# EAGLE design nrf24wifidongle (EAGLE 6.6.0)
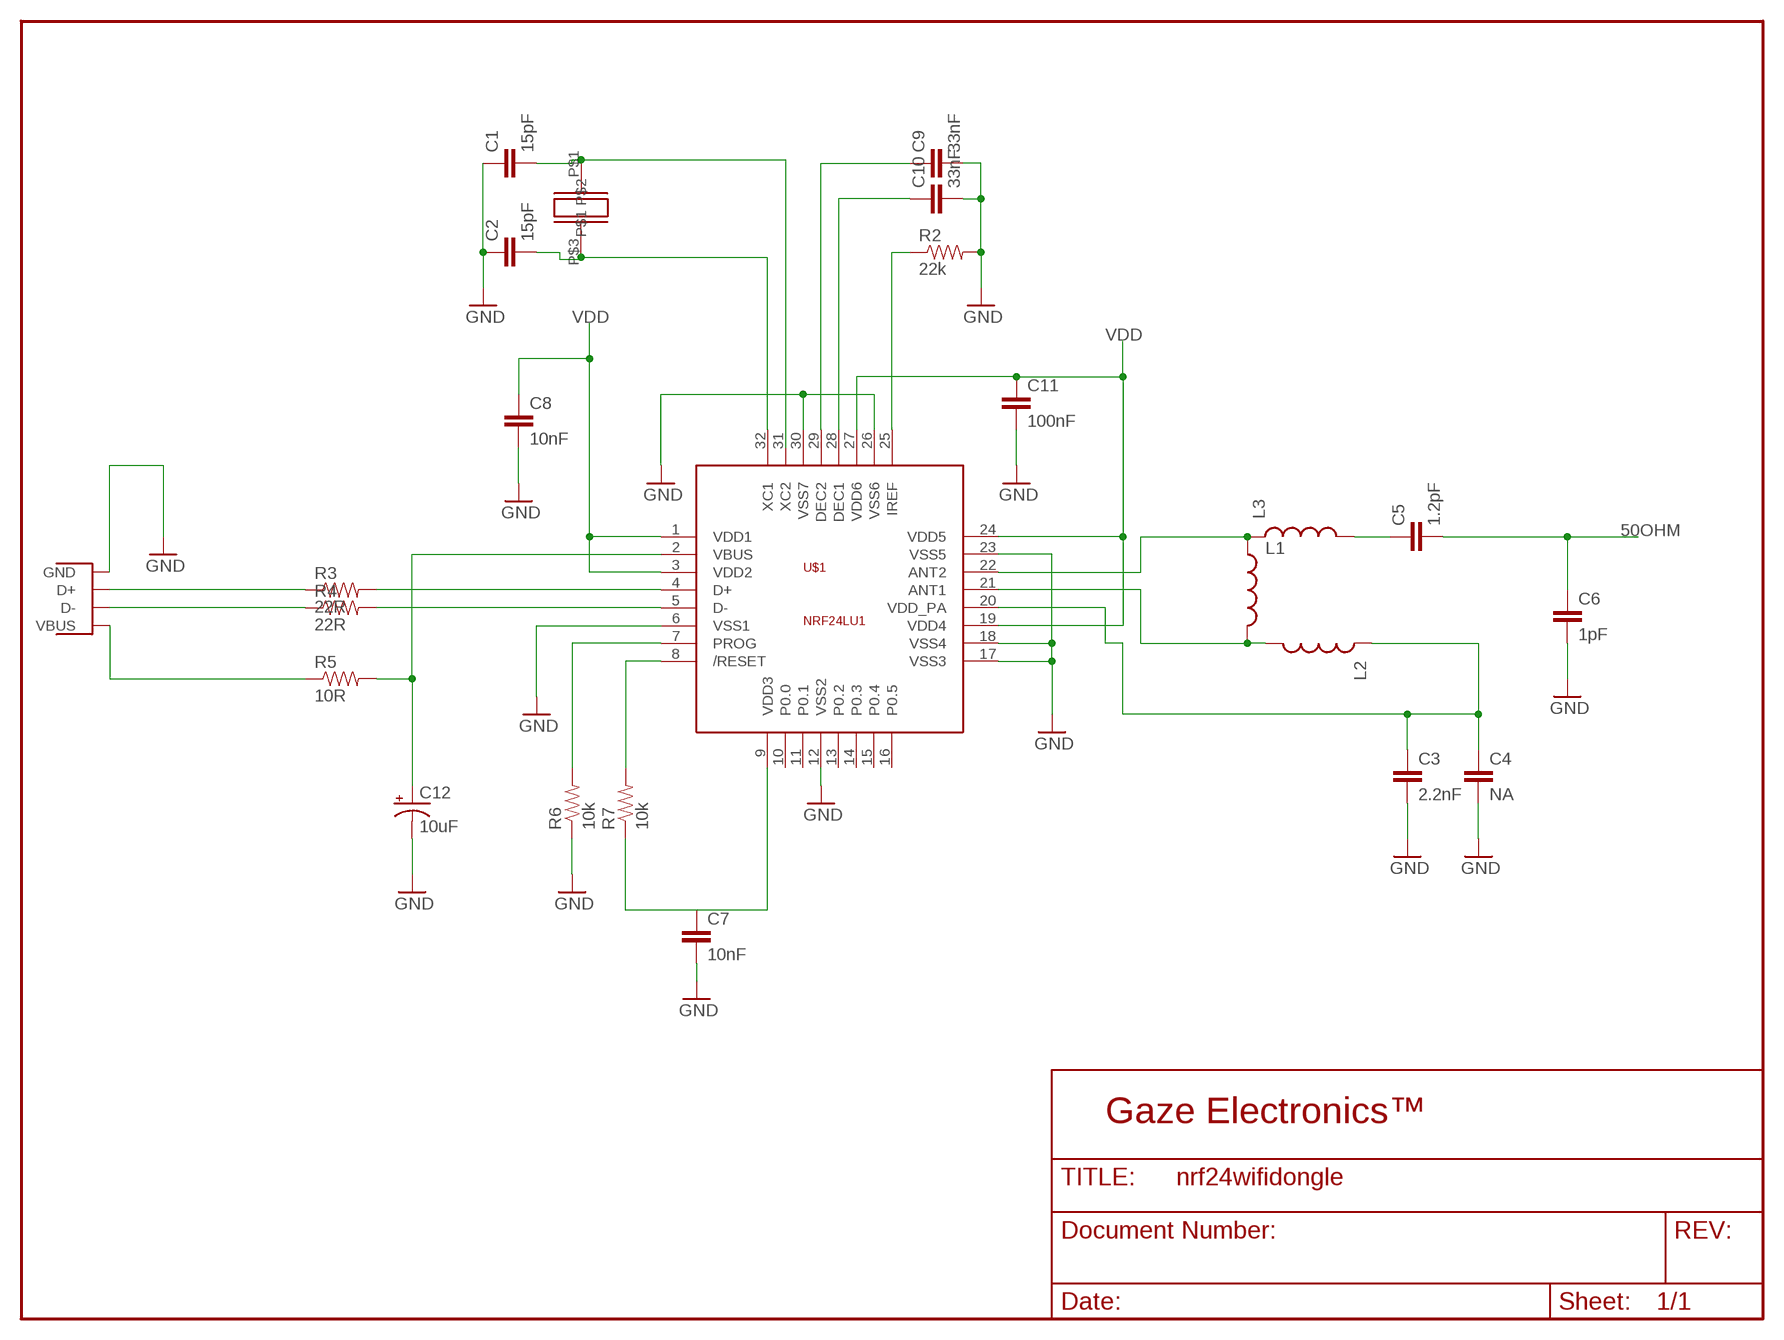
[diagram p0: schematic, sheet 1]

## Parts
C1  15pF  CAP0402  [C0402]
C2  15pF  CAP0402  [C0402]
C3  2.2nF  CAP0402  [C0402]
C4  NA  CAP0402  [C0402]
C5  1.2pF  CAP0402  [C0402]
C6  1pF  CAP0402  [C0402]
C7  10nF  CAP0402  [C0402]
C8  10nF  CAP0402  [C0402]
C9  33nF  CAP0402  [C0402]
C10  33nF  CAP0402  [C0402]
C11  100nF  CAP0402  [C0402]
C12  10uF  CAP_POL1206  [EIA3216]
L1  INDUCTOR0402  [C0402]
L2  INDUCTOR0402  [C0402]
L3  INDUCTOR0402  [C0402]
R2  22k  RESISTOR0402-RES  [0402-RES]
R3  22R  RESISTOR0402-RES  [0402-RES]
R4  22R  RESISTOR0402-RES  [0402-RES]
R5  10R  RESISTOR0402-RES  [0402-RES]
R6  10k  RESISTOR0402-RES  [0402-RES]
R7  10k  RESISTOR0402-RES  [0402-RES]
U$1  NRF24LU1  [QFN-32]
U$2  CFPX180  [CFPX180]
X1  USBPTH  [USB-B-PTH]

## Nets
50OHM: C5.2 C6.1
GND: C1.1 C2.1 C3.2 C4.2 C6.2 C7.2 C8.2 C9.2 C10.2 C11.2 C12.C(-) R2.2 R6.1 U$1.6(VSS1) U$1.12(VSS2) U$1.17(VSS3) U$1.18(VSS4) U$1.23(VSS5) U$1.26(VSS6) U$1.30(VSS7) X1.GND
N$1: R3.2 U$1.4(D+)
N$2: R4.2 U$1.5(D-)
N$3: R3.1 X1.D+
N$4: R4.1 X1.D-
N$5: C1.2 U$2.P$1
N$6: C2.2 U$1.32(XC1) U$2.P$3
N$7: C9.1 U$1.29(DEC2)
N$8: R5.1 X1.VBUS
N$9: C12.A(+) R5.2 U$1.2(VBUS)
N$10: R6.2 U$1.7(PROG)
N$11: R7.2 U$1.8(/RESET)
N$12: R7.1 U$1.9(VDD3)
N$13: R2.1 U$1.25(IREF)
N$14: C5.1 L3.2
N$15: C10.1 U$1.28(DEC1)
N$18: L1.1 L3.1 U$1.22(ANT2)
N$20: C3.1 C4.1 L2.1 U$1.20(VDD_PA)
N$21: L1.2 L2.2 U$1.21(ANT1)
VDD: C8.1 C11.1 U$1.1(VDD1) U$1.3(VDD2) U$1.19(VDD4) U$1.24(VDD5) U$1.27(VDD6)
Unconnected: C7.1 U$1.10(P0.0) U$1.11(P0.1) U$1.13(P0.2) U$1.14(P0.3) U$1.15(P0.4) U$1.16(P0.5) U$1.31(XC2)

## Library data of the parts
C1-C11 = CH_passive:CAP: Capacitor Standard 0603 ceramic capacitor, and 0.1" leaded capacitor.
C12 = CH_passive:CAP_POL: Capacitor Polarized These are standard SMD and PTH capacitors. Normally 10uF, 47uF, and 100uF in electrolytic and tantalum varieties. Always verify the external diameter of the through hole cap, it varies with capacity, voltage, and manufacturer. The EIA devices should be standard.
L1-L3 = CH_passive:INDUCTOR: Inductors Basic Inductor
R2-R7 = Gaze Electronics - Passives:RESISTOR: Resistor Basic schematic elements and footprints for 0603, 1206, and PTH resistors.
U$1 = Gaze Electronics - RF:NRF24LU1: 2.4GHz transceiver
U$2 = ABCDEFG:CFPX180
X1 = CH_connectors:USB: USB Connectors USB-B-PTH is fully proven SKU : PRT-00139 USB-miniB is fully proven SKU : PRT-00587 USB-A-PCB is untested. USB-A-H is C@H proven USB-B-SMT is throughly reviewed, but untested. Needs silkscreen touching up. USB-A-S has not been used/tested USB-MB-H has not been used/tested

## Board
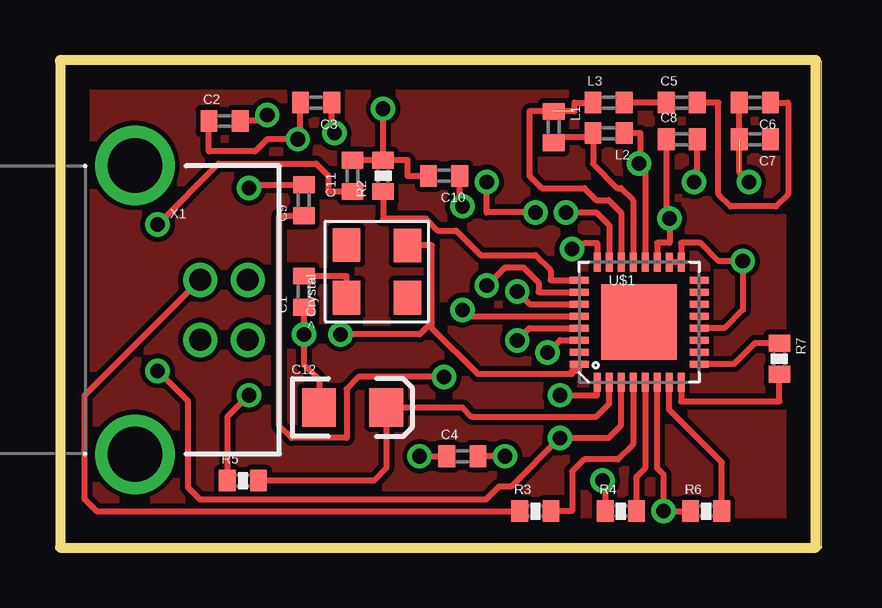
[diagram p1: board, top side]
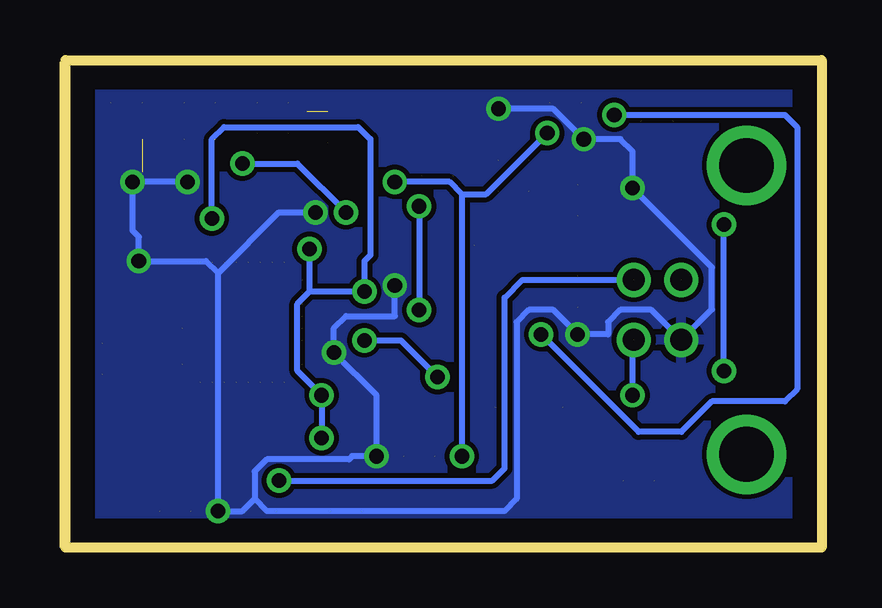
[diagram p2: board, bottom side, seen from below]

Size 31.73 x 20.32 mm. Coordinates in mm from the lower left corner, seen from the top.
Outline: 31.5,0 31.73,0 31.73,20.24 0,20.24
Outline: 31.5,0 0,0 0,20.24
Outline: 31.5,0 31.5,20.32 0,20.32 0,20.24
Copper layers (1*16): Top 0.035mm / dielectric 1.5mm / Bottom 0.035mm
Design rules "default": minimum track width 10mil, minimum drill 24mil, track to track 8mil, track to pad 8mil, pad to pad 8mil, via to via 8mil, smd to smd 8mil, copper to edge 40mil, drill to drill 8mil, minimum pad ring 10mil, minimum via ring 8mil, stop-mask expansion 4mil, vias tented up to drill 0mil, thermal gap 10mil

### Footprints (pad centres in the part's own frame; a part is rotated, then mirrored left to right if it is on the bottom)
C0402 = smd 0.7 x 0.9: 1 -0.65,0; 2 0.65,0
EIA3216 = smd 1.4 x 1.6: A 1.4,0; C -1.4,0
0402-RES = smd 0.7 x 0.9: 1 -0.65,0; 2 0.65,0
QFN-32 = smd 0.285 x 0.8: 1 -1.75,-2.5; 2 -1.25,-2.5; 3 -0.75,-2.5; 4 -0.25,-2.5; 5 0.25,-2.5; 6 0.75,-2.5; 7 1.25,-2.5; 8 1.75,-2.5; 17 1.75,2.5; 18 1.25,2.5; 19 0.75,2.5; 20 0.25,2.5; 21 -0.25,2.5; 22 -0.75,2.5; 23 -1.25,2.5; 24 -1.75,2.5 | smd 0.8 x 0.285: 9 2.5,-1.75; 10 2.5,-1.25; 11 2.5,-0.75; 12 2.5,-0.25; 13 2.5,0.25; 14 2.5,0.75; 15 2.5,1.25; 16 2.5,1.75; 25 -2.5,1.75; 26 -2.5,1.25; 27 -2.5,0.75; 28 -2.5,0.25; 29 -2.5,-0.25; 30 -2.5,-0.75; 31 -2.5,-1.25; 32 -2.5,-1.75 | smd 3.15 x 3.15: EP 0,0
CFPX180 = smd 1.4 x 1.15: P$1 0,0; P$2 0,-2.54; P$3 2.18,-2.54; P$4 2.19,0
USB-B-PTH = drill 0.914: D+ 0,1.25; D- 1.981,1.25; GND 0,-1.25; VBUS 1.981,-1.25 | drill 2.286: P$1 -2.718,-6.02; P$2 -2.718,6.02

### Placement (x,y rotation side)
C1  10.16,10.67 90 top
C2  6.86,17.78 0 top
C3  10.67,18.54 180 top
C4  16.76,3.81 0 top
C5  25.91,18.54 0 top
C6  28.96,18.54 180 top
C7  28.96,17.02 180 top
C8  25.91,17.02 0 top
C9  10.16,14.48 90 top
C10  16,15.49 180 top
C11  12.19,15.49 90 top
C12  12.19,5.84 0 top
L1  20.57,17.53 270 top
L2  22.86,17.27 180 top
L3  22.86,18.54 0 top
R2  13.46,15.49 90 top
R3  19.81,1.52 0 top
R4  23.37,1.52 0 top
R5  7.62,2.79 0 top
R6  26.92,1.52 0 top
R7  29.97,7.87 270 top
U$1  24.13,9.4 0 top
U$2  11.94,10.41 90 top
X1  5.84,9.91 0 top

### Tracks (layer width: path | path; a pad name or v marks a point on that pad's centre or on a via)
50OHM  (2 unrouted)
  Top 0.254: C6.1 30.34,18.54 30.34,14.73 29.83,14.22 27.94,14.22 27.43,14.73 27.43,18.54 C5.2
GND  (via drill 0.61 pad 1.02)  (20 unrouted)
  Top 0.254: U$1.18 U$1.17 25.88,12.7 26.67,12.7 27.43,11.94 v28.45,11.94 28.45,9.91 27.69,9.15 U$1.12 | v21.08,13.97 22.35,13.97 22.88,13.44 U$1.23 | C2.1 6.21,16.51 8.13,16.51 8.64,17.02 v9.91,17.02 10.02,17.13 C3.2 | R2.2 14.48,16.14 14.48,15.49 C10.2 | R2.2 C11.2 | C1.1 v10.16,8.89 10.16,7.62 10.79,6.99 C12.C | U$1.6 24.88,3.31 25.15,3.05 v25.15,1.52 R6.1 | v17.78,10.92 18.54,11.68 19.3,11.68 19.94,11.05 19.94,10.65 U$1.26 | v26.42,15.24 26.54,15.37 26.54,17.02 C8.2 | v28.7,15.24 28.31,15.64 C6.2 | R2.2 v13.46,18.29 | v20.32,8.13 20.84,8.65 U$1.30 | v7.87,14.99 8.02,15.13 C9.2 | v18.54,3.81 C4.2
  Bottom 0.254: 23.62,2.03 23.11,1.52 13.21,1.52 12.7,2.03 12.7,9.4 12.19,9.91 11.18,9.91 v10.16,8.89 8.89,8.89 8.89,9.4 8.38,9.91 7.09,9.91 X1.GND 4.57,9.93 4.57,11.68 v7.87,14.99 7.87,16.51 8.38,17.02 v9.91,17.02 11.18,18.29 v13.46,18.29 | 23.62,2.03 23.62,3.17 23.11,3.68 19.68,3.68 19.56,3.81 v18.54,3.81 18.54,6.35 v20.32,8.13 20.32,9.14 19.81,9.65 17.78,9.65 v17.78,10.92 | 25.15,11.43 22.61,13.97 v21.08,13.97 | 25.15,11.43 v25.15,1.52 24.13,1.52 23.62,2.03 | 25.15,11.43 25.65,11.94 v28.45,11.94 28.45,12.95 28.7,13.21 v28.7,15.24 v26.42,15.24
  pour Bottom: 0,0 31.5,0 31.5,20.32 0,20.32
N$1  (2 unrouted)
  Top 0.254: U$1.4 23.88,4.32 23.25,3.68 21.84,3.68 21.34,3.17 21.34,1.52 R3.2
N$2  (2 unrouted)
  Top 0.254: U$1.5 24.38,3.3 24.02,2.94 R4.2
N$3  (2 unrouted)
  Top 0.254: X1.D+ 1.02,6.33 1.02,2.03 1.52,1.52 R3.1
N$4  (via drill 0.61 pad 1.02)  (2 unrouted)
  Top 0.254: v22.61,2.79 22.72,2.68 R4.1
  Bottom 0.254: v22.61,2.79 13.72,2.79 13.21,3.3 13.21,10.41 12.47,11.16 X1.D-
N$5  (1 unrouted)
  Top 0.254: U$2.P$1 11.94,11.32 C1.2
N$6  (via drill 0.61 pad 1.02)  (3 unrouted)
  Top 0.254: 15.49,9.4 15.49,12.59 U$2.P$3 | 15.49,9.4 14.99,8.89 v11.68,8.89 | v8.64,18.03 8.38,17.78 C2.2 | 15.49,9.4 15.49,9.14 17.4,7.24 21.34,7.24 21.34,7.37 21.63,7.37 U$1.32
  Bottom 0.254: v8.64,18.03 1.52,18.03 1.02,17.53 1.02,6.6 1.52,6.1 4.57,6.1 5.84,4.83 7.62,4.83 v11.68,8.89
N$7  (via drill 0.61 pad 1.02)  (2 unrouted)
  Top 0.254: v16,7.11 12.45,7.11 11.94,6.6 11.94,4.57 9.65,4.57 9.14,5.08 9.14,13.83 C9.1 | v19.05,8.64 19.56,9.15 U$1.29
  Bottom 0.254: v19.05,8.64 17.53,8.64 v16,7.11
N$8  (via drill 0.61 pad 1.02)  (2 unrouted)
  Top 0.254: v7.87,6.35 6.97,5.45 R5.1
  Bottom 0.254: v7.87,6.35 7.87,8.61 X1.VBUS
N$9  (3 unrouted)
  Top 0.254: R5.2 13.08,2.79 13.59,3.3 C12.A 16.76,5.84 17.14,5.46 22.35,5.46 22.88,5.99 U$1.2
N$10  (2 unrouted)
  Top 0.254: R6.2 27.57,3.56 25.38,5.75 U$1.7
N$11  (2 unrouted)
  Top 0.254: U$1.8 25.88,6.1 29.97,6.1 R7.2
N$12  (2 unrouted)
  Top 0.254: R7.1 28.96,8.52 28.08,7.65 U$1.9
N$13  (2 unrouted)
  Top 0.254: R2.1 13.46,13.72 15.24,13.72 15.75,13.21 16.51,13.21 17.53,12.19 19.81,12.19 20.45,11.56 20.45,11.15 U$1.25
N$14  (2 unrouted)
  Top 0.254: C5.1 L3.2
N$15  (via drill 0.61 pad 1.02)  (2 unrouted)
  Top 0.254: v16.76,9.91 17.02,9.65 U$1.28 | v16.76,14.22 16.65,14.34 C10.1
  Bottom 0.254: v16.76,14.22 v16.76,9.91
N$17
  pour Top: 0,0 31.5,0 31.5,20.32 0,20.32
N$18  (3 unrouted)
  Top 0.254: U$1.22 23.38,13.96 22.86,14.48 22.35,14.48 21.84,14.99 20.07,14.99 19.56,15.49 19.56,18.18 21.44,18.18 21.44,18.54 L3.1
N$20  (via drill 0.61 pad 1.02)  (4 unrouted)
  Top 0.254: L2.1 24.19,17.27 24.19,16.06 v24.13,16 24.38,15.75 U$1.20 | v11.43,17.27 11.32,17.38 C3.1 | v19.81,13.97 17.78,13.97 v17.78,15.24 | v14.99,3.81 C4.1
  Bottom 0.254: 14.99,14.73 13.97,14.73 v11.43,17.27 | 14.99,14.73 15.49,15.24 v17.78,15.24 | v24.13,16 21.84,16 v19.81,13.97 | 14.99,14.73 v14.99,3.81
N$21  (3 unrouted)
  Top 0.254: 22.21,17.1 22.21,16 23.23,14.99 23.37,14.99 23.88,14.47 U$1.21 | 22.21,17.1 20.57,17.1 L1.2 | 22.21,17.1 L2.2
VDD  (via drill 0.61 pad 1.02)  (7 unrouted)
  Top 0.254: U$1.3 23.38,5.09 22.86,4.57 v20.83,4.57 18.8,2.54 18.29,2.54 17.75,2 5.84,2 5.33,2.5 5.33,6.1 v4.06,7.37 | U$1.19 24.88,12.7 25.4,12.7 v25.4,13.72 25.27,13.84 25.27,17.02 C8.1 | v4.06,13.46 6.6,16 10.67,16 11.18,15.49 11.18,14.84 C11.1 | v19.05,10.67 19.57,10.15 U$1.27 | v21.34,12.45 21.59,12.45 21.84,12.7 22.38,12.7 U$1.24 | v20.83,6.35 22.38,6.35 U$1.1
  Bottom 0.254: 21.34,10.67 21.84,10.16 21.84,7.37 v20.83,6.35 v20.83,4.57 | 21.34,10.67 v19.05,10.67 19.05,11.94 18.8,12.19 18.8,17.02 19.3,17.53 24.89,17.53 25.4,17.02 v25.4,13.72 | v21.34,12.45 21.34,10.67 | v4.06,7.37 v4.06,13.46